# EAGLE design v0.2_4ch (EAGLE 7.6.0)
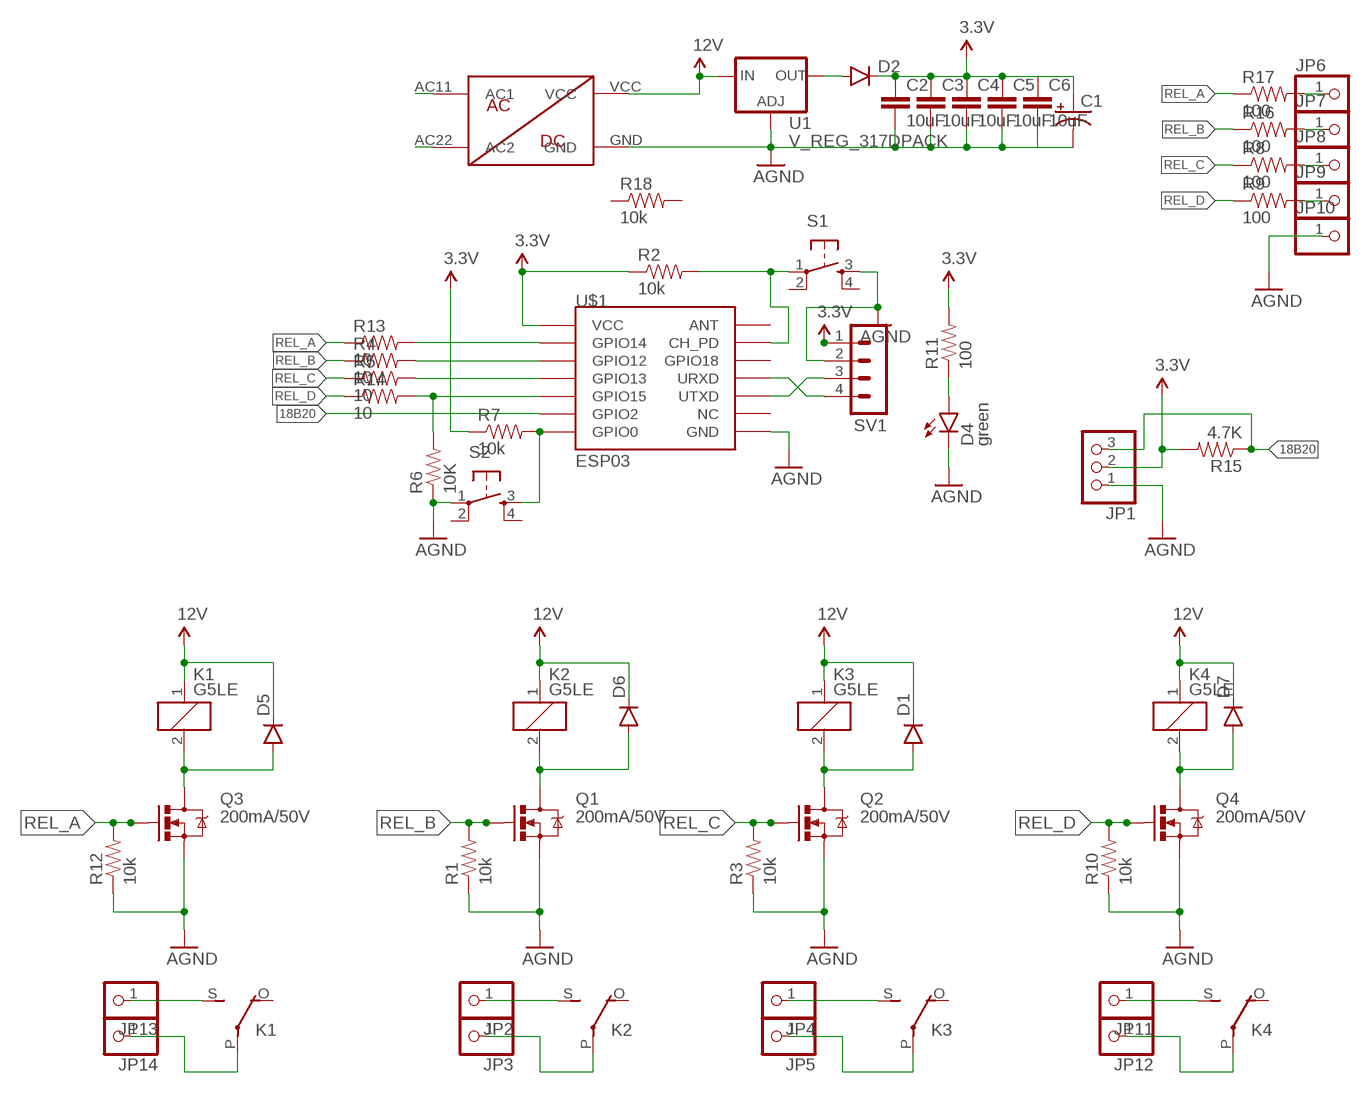
[diagram p0: schematic, sheet 1]

## Parts
C1  CAP_POLPTH3  [CPOL-RADIAL-1000UF-63V]
C2  10uF  10UF-6.3V-20%(0603)  [0603-CAP]
C3  10uF  10UF-6.3V-20%(0603)  [0603-CAP]
C4  10uF  10UF-6.3V-20%(0603)  [0603-CAP]
C5  10uF  10UF-6.3V-20%(0603)  [0603-CAP]
C6  10uF  10UF-6.3V-20%(0603)  [0603-CAP]
D1  DIODESOD123  [SOD-123]
D2  DIODESOD123  [SOD-123]
D4  green  LED0603  [LED-0603]
D5  DIODESOD123  [SOD-123]
D6  DIODESOD123  [SOD-123]
D7  DIODESOD123  [SOD-123]
JP1  PINHD-1X3  [1X03]
JP2  PINHD-1X1  [1X01]
JP3  PINHD-1X1  [1X01]
JP4  PINHD-1X1  [1X01]
JP5  PINHD-1X1  [1X01]
JP6  PINHD-1X1  [1X01]
JP7  PINHD-1X1  [1X01]
JP8  PINHD-1X1  [1X01]
JP9  PINHD-1X1  [1X01]
JP10  PINHD-1X1  [1X01]
JP11  PINHD-1X1  [1X01]
JP12  PINHD-1X1  [1X01]
JP13  PINHD-1X1  [1X01]
JP14  PINHD-1X1  [1X01]
K1  G5LE  [G5LE]
K2  G5LE  [G5LE]
K3  G5LE  [G5LE]
K4  G5LE  [G5LE]
Q1  200mA/50V  MOSFET-NCHANNELBSS138  [SOT23-3]
Q2  200mA/50V  MOSFET-NCHANNELBSS138  [SOT23-3]
Q3  200mA/50V  MOSFET-NCHANNELBSS138  [SOT23-3]
Q4  200mA/50V  MOSFET-NCHANNELBSS138  [SOT23-3]
R1  10k  RESISTOR0805-RES  [0805]
R2  10k  RESISTOR0805-RES  [0805]
R3  10k  RESISTOR0805-RES  [0805]
R4  10  RESISTOR0805-RES  [0805]
R5  10  RESISTOR0805-RES  [0805]
R6  10K  RESISTOR0805-RES  [0805]
R7  10k  RESISTOR0805-RES  [0805]
R8  100  RESISTOR0805-RES  [0805]
R9  100  RESISTOR0805-RES  [0805]
R10  10k  RESISTOR0805-RES  [0805]
R11  100  RESISTOR0805-RES  [0805]
R12  10k  RESISTOR0805-RES  [0805]
R13  10  RESISTOR0805-RES  [0805]
R14  10  RESISTOR0805-RES  [0805]
R15  4.7K  RESISTOR0805-RES  [0805]
R16  100  RESISTOR0805-RES  [0805]
R17  100  RESISTOR0805-RES  [0805]
R18  10k  RESISTOR0805-RES  [0805]
S1  TAC_SWITCHPTH  [TACTILE-PTH]
S2  TAC_SWITCHPTH  [TACTILE-PTH]
SV1  MA04-1  [MA04-1]
U1  V_REG_317DPACK  [V-REG_DPACK]
U$1  ESP03  [ESP03]
U$8  ACDC12V350MA  [ACDC12V350MA]

## Nets
3.3V: C1.1(+) C2.1 C3.1 C4.1 C5.1 C6.1 D2.C JP1.2 R2.1 R7.1 R11.2 R15.2 SV1.1 U$1.VCC
12V: D1.C D5.C D6.C D7.C K1.1 K2.1 K3.1 K4.1 U1.3(IN) U$8.VCC
18B20: JP1.3 R15.1 U$1.GPIO2
AGND: C1.2(-) C2.2 C3.2 C4.2 C5.2 C6.2 D4.C JP1.1 JP10.1 Q1.2(S) Q2.2(S) Q3.2(S) Q4.2(S) R1.1 R3.1 R6.1 R10.1 R12.1 S1.3 S2.1 SV1.2 U1.1(ADJ) U$1.GND U$8.GND
N$1: SV1.3 U$1.UTXD
N$2: SV1.4 U$1.URXD
N$3: D5.A K1.2 Q3.3(D)
N$4: R2.2 S1.1 U$1.CH_PD
N$5: U$8.AC11(AC1)
N$6: R4.2 U$1.GPIO12
N$7: R5.2 U$1.GPIO13
N$8: R6.2 R14.2 U$1.GPIO15
N$9: JP8.1 R8.2
N$10: JP9.1 R9.2
N$11: U$8.AC22(AC2)
N$12: R7.2 S2.3 U$1.GPIO0
N$16: D4.A R11.1
N$17: D6.A K2.2 Q1.3(D)
N$18: D7.A K4.2 Q4.3(D)
N$19: D1.A K3.2 Q2.3(D)
N$20: R13.2 U$1.GPIO14
N$21: JP13.1 K1.S(2:S)
N$22: JP14.1 K1.P(2:P)
N$23: JP12.1 K4.P(2:P)
N$24: JP11.1 K4.S(2:S)
N$25: JP5.1 K3.P(2:P)
N$26: JP4.1 K3.S(2:S)
N$27: JP2.1 K2.S(2:S)
N$28: JP3.1 K2.P(2:P)
N$29: JP7.1 R16.2
N$30: JP6.1 R17.2
N$40: D2.A U1.4(OUT)
REL_A: Q3.1(G) R12.2 R13.1 R17.1
REL_B: Q1.1(G) R1.2 R4.1 R16.1
REL_C: Q2.1(G) R3.2 R5.1 R8.1
REL_D: Q4.1(G) R9.1 R10.2 R14.1
Unconnected: K1.O(2:O) K2.O(2:O) K3.O(2:O) K4.O(2:O) R18.1 R18.2 S1.2 S1.4 S2.2 S2.4 U$1.ANT U$1.GPIO18 U$1.NC

## Library data of the parts
C1 = SparkFun-Passives:CAP_POL: Capacitor Polarized These are standard SMD and PTH capacitors. Normally 10uF, 47uF, and 100uF in electrolytic and tantalum varieties. Always verify the external diameter of the through hole cap, it varies with capacity, voltage, and manufacturer. The EIA devices should be standard.
C2-C6 = SparkFun-Capacitors:10UF-6.3V-20%(0603): CAP-11015; PROD_ID: CAP-11015
D1 D2 D5-D7 = SparkFun-DiscreteSemi:DIODE: Diode These are standard reverse protection diodes and small signal diodes. SMA package can handle up to about 1A. SOD-323 can handle about 200mA. What the SOD-323 package when ordering, there are some mfgs out there that are 5-pin packages.
D4 = SparkFun-LED:LED: LEDs Standard schematic elements and footprints for 5mm, 3mm, 1206, and 0603 sized LEDs. 5mm - Spark Fun Electronics SKU : COM-00529 (and others)
JP1 = pinhead:PINHD-1X3: PIN HEADER
JP2-JP14 = pinhead:PINHD-1X1: PIN HEADER
K1-K4 = relay:G5LE: RELAY 1 x switch, 10 A/120 V AC, 8 A/30 V DC, Omron; OC_FARNELL: unknown; OC_NEWARK: unknown
Q1-Q4 = SparkFun-DiscreteSemi:MOSFET-NCHANNEL: Common NMOSFET Parts MFG P/N Store ID Prod ID FDD8780 TRANS-09984 SI7820DN TRANS-11055 FDS6630A IC-08089 2N7002PW TRANS-11151 FQP30N06L COM-10213 TRANS-10060 BSS123LT1G TRANS-08345 BSS138 TRANS-00830 BS170 2N7000; PROD_ID: TRANS-00830
R1-R18 = SparkFun-Passives:RESISTOR: Resistor Basic schematic elements and footprints for 0603, 1206, and PTH resistors.
S1 S2 = SparkFun-Retired:TAC_SWITCH: Momentary Switch Button commonly used for reset or general input. Spark Fun Electronics SKU : COM-00097 SMT- SWCH-08247
SV1 = con-lstb:MA04-1: PIN HEADER; OC_FARNELL: unknown; OC_NEWARK: unknown
U1 = SparkFun-PowerIC:V_REG_317: Voltage Regulator Standard LM317 adjustable voltage regulator. AOI (Adjust Output Input). Google 'LM317 Calculator' for easy to use app to get the two resistor values needed. 240/720 for 5V output. 240/390 for 3.3V output. Spark Fun Electronics SKU : COM-00527; PROD_ID: IC-09888
U$1 = esp8266modules:ESP03: ESP8266 Wifi module 03; DIMENSIONS: 17.3 x 12.1 mm; PINS: 14; PITCH: 0.078" / 2 mm
U$8 = rel:ACDC12V350MA

## Board
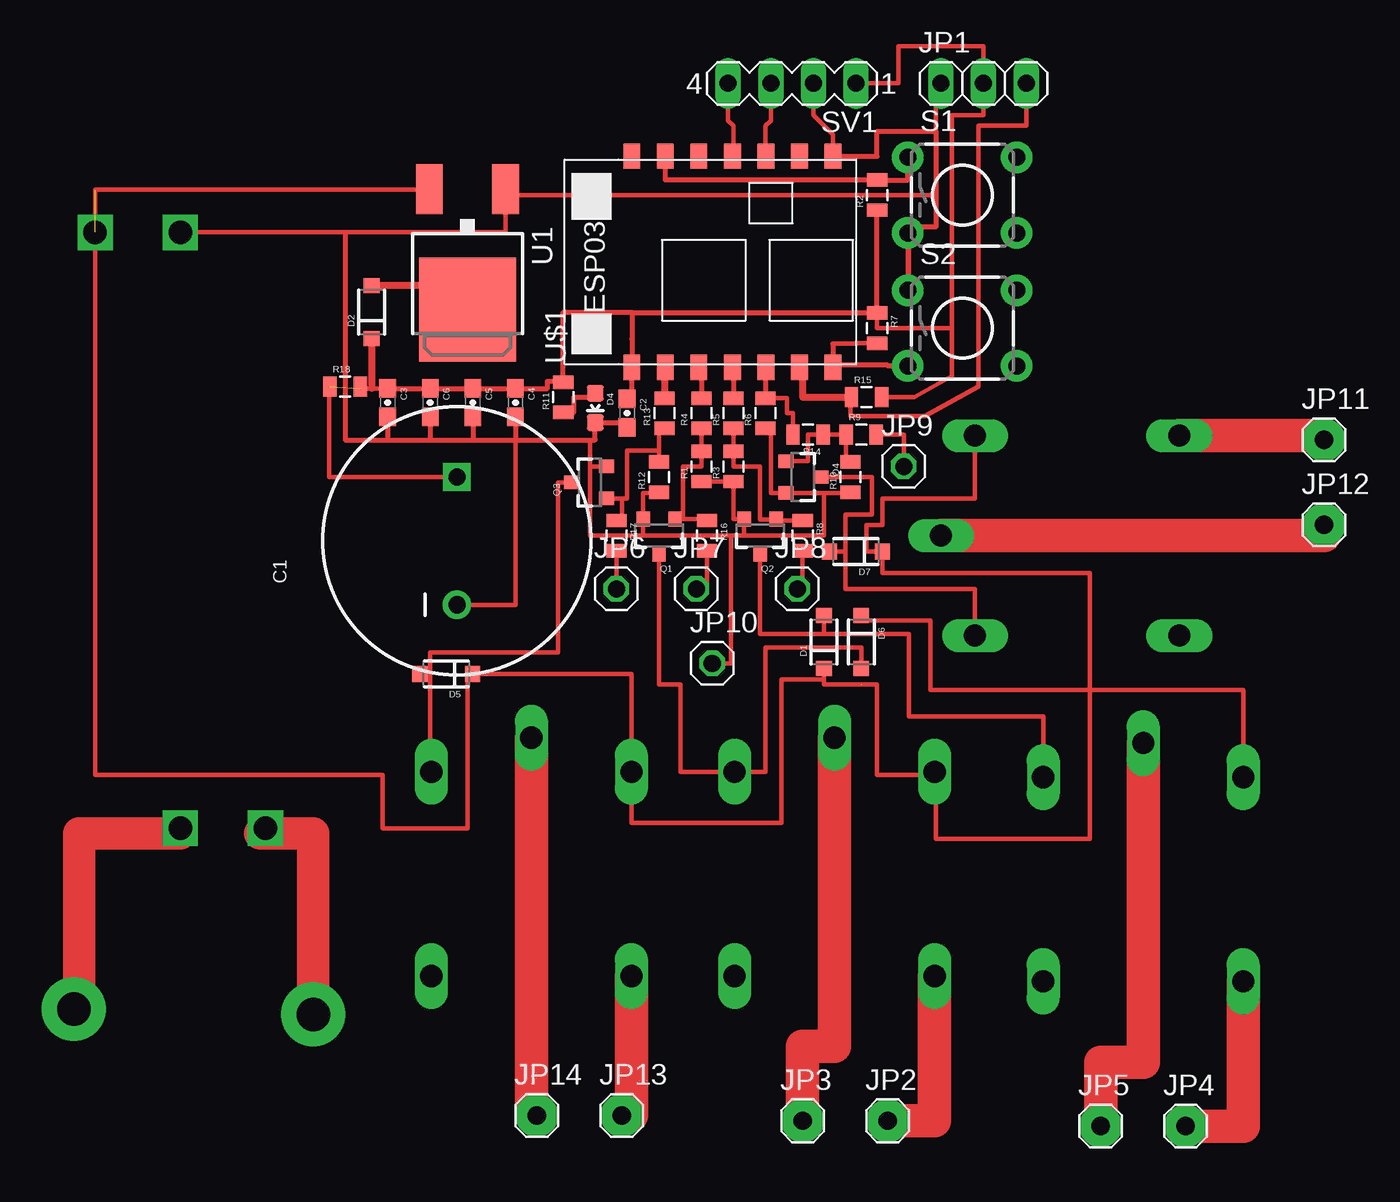
[diagram p1: board, top side]
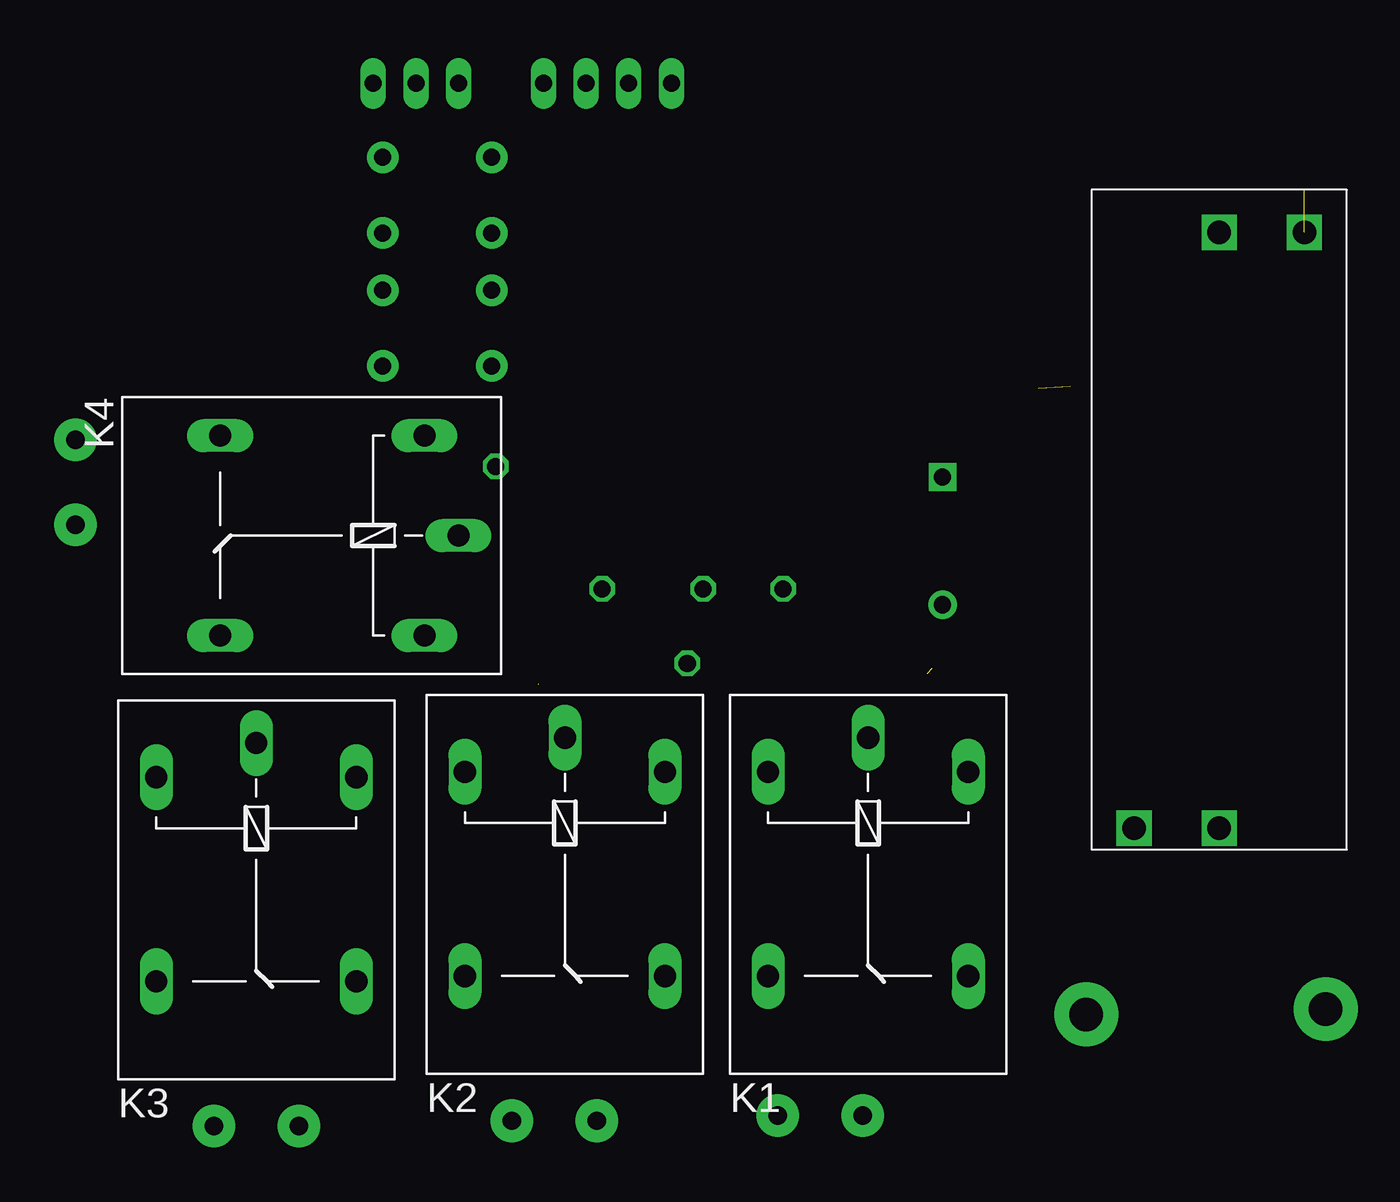
[diagram p2: board, bottom side, seen from below]

No outline drawn. Coordinates in mm, seen from the top.
Copper layers (1*16): Top 0.035mm / dielectric 1.5mm / Bottom 0.035mm
Design rules "default": minimum track width 10mil, minimum drill 24mil, track to track 8mil, track to pad 8mil, pad to pad 8mil, via to via 8mil, smd to smd 8mil, copper to edge 40mil, drill to drill 8mil, minimum pad ring 10mil, minimum via ring 8mil, stop-mask expansion 4mil, vias tented up to drill 0mil, thermal gap 10mil

### Footprints (pad centres in the part's own frame; a part is rotated, then mirrored left to right if it is on the bottom)
CPOL-RADIAL-1000UF-63V = drill 1.016 pad 1.651 square: 1 3.81,0 | drill 1.016 pad 1.676: 2 -3.81,0
0603-CAP = smd 1.1 x 1: 1 -0.85,0; 2 0.85,0
SOD-123 = smd 0.9 x 0.95: A 1.575,0; C -1.575,0
LED-0603 = smd 1 x 1: A 0,-0.877; C 0,0.877
1X03 = drill 1.016 long: 1 -2.54,0; 2 0,0; 3 2.54,0
1X01 = drill 1.016 octagon: 1 0,0
G5LE = drill 1.321 long: 1 -7.493,-5.969; 2 -7.493,5.969; O 4.699,5.969; P -9.525,0; S 4.699,-5.969
SOT23-3 = smd 0.8 x 0.9: 1 -0.95,-1; 2 0.95,-1; 3 0,1.1
0805 = smd 0.8 x 1.2: 1 -0.9,0; 2 0.9,0
TACTILE-PTH = drill 1.016 pad 1.88: 1 -3.251,2.261; 2 3.251,2.261; 3 -3.251,-2.261; 4 3.251,-2.261
MA04-1 = drill 1.016 long: 1 -3.81,0; 2 -1.27,0; 3 1.27,0; 4 3.81,0
V-REG_DPACK = smd 1.6 x 3: 1 -2.28,-4.8; 3 2.28,-4.8 | smd 5.8 x 6.2: 4 0,2.38
ESP03 = smd 1.5 x 1: ANT 7.4,4.8; CH_PD 7.4,2.8; GND 7.4,-7.2; GPIO0 -5.2,-7.2; GPIO2 -5.2,-5.2; GPIO12 -5.2,0.8; GPIO13 -5.2,-1.2; GPIO14 -5.2,2.8; GPIO15 -5.2,-3.2; GPIO18 7.4,0.8; NC 7.4,-5.2; URXD 7.4,-1.2; UTXD 7.4,-3.2; VCC -5.2,4.8
ACDC12V350MA = drill 1.4 square: AC11 1.27,12.7; AC22 1.27,7.62; GND 36.83,7.62; VCC 36.83,2.54

### Placement (x,y rotation side)
C1  29.21,38.1 90 top
C2  39.37,45.72 270 top
C3  25.08,46.35 270 top
C4  32.7,46.35 270 top
C5  30.16,46.35 270 top
C6  27.62,46.35 270 top
D1  51.12,32.07 90 top
D2  24.13,51.75 90 top
D4  37.47,46.04 180 top
D5  28.57,30.16 180 top
D6  53.34,32.07 270 top
D7  53.02,37.47 180 top
JP1  60.64,65.41 0 top
JP2  54.93,3.49 0 top
JP3  49.85,3.49 0 top
JP4  72.71,3.17 0 top
JP5  67.63,3.17 0 top
JP6  38.73,35.24 0 top
JP7  43.5,35.24 0 top
JP8  49.53,35.24 0 top
JP9  55.88,42.55 0 top
JP10  44.45,30.8 0 top
JP11  80.96,44.13 0 top
JP12  80.96,39.05 0 top
JP13  39.05,3.81 0 top
JP14  33.97,3.81 0 top
K1  33.66,16.83 270 bottom
K2  51.75,16.83 270 bottom
K3  70.17,16.51 270 bottom
K4  67.63,38.42 180 bottom
Q1  41.27,38.42 180 top
Q2  47.31,38.42 180 top
Q3  37.15,41.59 90 top
Q4  49.85,41.91 270 top
R1  43.81,42.55 90 top
R2  54.29,58.74 90 top
R3  45.72,42.55 90 top
R4  43.81,45.72 90 top
R5  45.72,45.72 90 top
R6  47.62,45.72 90 top
R7  54.29,50.8 270 top
R8  49.85,38.42 270 top
R9  53.34,44.45 0 top
R10  52.7,41.91 90 top
R11  35.56,46.67 90 top
R12  41.27,41.91 90 top
R13  41.59,45.72 90 top
R14  50.16,44.45 180 top
R15  53.66,46.67 0 top
R16  44.13,38.42 270 top
R17  38.73,38.42 270 top
R18  22.54,47.31 0 top
S1  59.37,58.74 0 top
S2  59.37,50.8 0 top
SV1  49.21,65.41 180 top
U1  29.84,54.29 180 top
U$1  44.45,53.66 90 top
U$8  5.08,19.68 90 bottom

### Tracks (layer width: path | path; a pad name or v marks a point on that pad's centre or on a via)
3.3V  (1 unrouted)
  Top 0.254: R15.2 56.52,46.67 58.74,47.94 58.74,50.8 | 58.74,50.8 54.29,50.8 R7.1 | C3.1 24.13,47.2 23.5,47.2 23.5,47.31 | C1.1 21.59,41.91 21.59,47.31 | SV1.1 55.56,65.41 55.56,67.63 60.64,67.63 JP1.2 60.64,63.5 58.74,63.5 58.74,50.8
  Top 0.305: 39.69,51.7 R7.1 R2.1 | 39.69,51.7 39.69,51.75 35.56,51.75 R11.2 35.56,47.62 34.61,47.62 34.61,47.2 C4.1 C5.1 C6.1 C3.1 | 39.69,51.7 39.69,50.16 39.65,50.16 U$1.VCC 39.65,46.57 C2.1
  Top 0.406: D2.C 24.13,47.2
12V  (3 unrouted)
  Top 0.254: 53.33,29.53 51.12,29.53 51.12,29.84 | 51.12,29.84 48.58,29.84 48.58,21.27 39.62,21.27 K1.1 39.62,30.16 D5.C | 66.99,29.21 66.99,20.32 57.78,20.32 57.78,24.32 K2.1 57.72,24.13 54.29,24.13 54.29,29.53 53.34,29.53 | 66.99,29.21 76.14,29.21 K3.1 | 66.99,29.21 66.99,36.2 54.61,36.2 54.61,37.15 D7.C 53.66,37.47 53.66,39.05 54.61,39.05 54.61,40.64 60.13,40.64 K4.1 | 29.84,30.48 29.84,20.95 24.77,20.95 24.77,24.13 7.62,24.13 7.62,59.05 27.57,59.05 U1.3 | D1.C 51.12,29.84 | 66.99,29.21 57.47,29.21 57.47,33.34 53.34,33.34 D6.C
18B20
  Top 0.254: 49.85,46.67 52.7,46.67 52.7,45.56 57.15,45.56 60.33,47.31 60.33,62.87 63.18,62.87 JP1.3
  Top 0.406: U$1.GPIO2 49.85,48.46 49.85,46.67 R15.1
AGND
  Top 0.254: U$8.GND 22.54,56.52 32.12,56.52 32.12,58.74 | 37.47,44.13 37.15,44.13 37.15,42.55 | 37.15,42.55 Q3.2 | 37.15,42.55 37.15,38.42 40.32,38.42 | 40.32,38.42 40.33,38.42 | 40.33,38.42 Q1.2 | Q1.2 40.32,38.42 | 40.33,38.42 45.56,38.42 | 45.56,38.42 46.36,38.42 | 46.36,38.42 Q2.2 45.72,39.42 R3.1 R1.1 | Q1.2 40.32,40.96 41.27,40.96 R12.1 | 51.12,40.96 Q4.2 47.94,40.96 47.94,44.82 R6.1 | 51.12,40.96 51.12,38.42 46.36,38.42 | 51.12,40.96 52.7,40.96 R10.1 | S2.1 56.2,53.06 56.2,56.83 | 57.78,58.74 32.12,58.74 | 32.12,58.74 U1.1 | JP10.1 45.56,30.8 45.56,38.42 | C1.2 32.7,34.29 32.7,44.13 | U$1.GND 51.65,62.33 50.48,63.5 SV1.2 | JP1.1 57.78,65.41 57.78,62.55
  Top 0.305: S2.1 S1.3 56.12,56.83 56.2,56.83 57.78,56.83 57.78,58.74 57.78,62.55 54.29,62.55 54.29,61.06 U$1.GND | 25.08,44.13 22.54,44.13 22.54,56.52 | 25.08,44.13 27.62,44.13 | 27.62,44.13 30.16,44.13 | 30.16,44.13 32.7,44.13 | C3.2 25.08,44.13 | C6.2 27.62,44.13 | C5.2 30.16,44.13 | C4.2 32.7,44.13 | 32.7,44.13 37.47,44.13 D4.C 39.69,45.16 C2.2
N$1
  Top 0.254: SV1.3 47.94,63.18 47.62,62.87 47.62,61.08 U$1.UTXD
N$2
  Top 0.254: SV1.4 45.4,63.18 45.72,62.87 45.72,61.13 U$1.URXD
N$3
  Top 0.254: K1.2 27.62,24.32 27.62,30.16 | Q3.3 35.24,41.59 35.24,31.43 27.62,31.43 27.62,30.16 | D5.A 27.62,30.16
N$4
  Top 0.305: U$1.CH_PD | 41.54,61.06 U$1.CH_PD | U$1.CH_PD 41.65,59.64 R2.2 56.12,59.64 S1.1
N$6
  Top 0.305: U$1.GPIO12 43.81,48.46 R4.2
N$7
  Top 0.305: U$1.GPIO13 45.72,48.46 R5.2
N$8
  Top 0.254: R6.2 48.9,46.62 48.9,45.72 49.27,45.72 R14.2
  Top 0.305: U$1.GPIO15 47.62,48.46 R6.2
N$9
  Top 0.254: JP8.1 49.85,35.24 R8.2
N$10
  Top 0.254: JP9.1 55.88,44.45 R9.2
N$12
  Top 0.305: R7.2 51.65,49.85 U$1.GPIO0 51.65,48.58 54.93,48.58 54.93,48.54 S2.3
N$13
  Top 1.93: 12.7,20.64 6.67,20.64 6.67,10.16
N$14  (via drill 2 pad 3.81)
  other vias: 6.35,10.16
N$15  (via drill 2 pad 3.81)
  Top 1.93: 17.46,20.64 20.64,20.64 v20.64,9.84
N$16
  Top 0.305: R11.1 36.2,45.77 36.2,46.67 37.47,46.67 D4.A
N$17
  Top 0.254: Q1.3 41.27,29.53 42.55,29.53 42.55,24.32 K2.2 47.62,24.32 47.62,31.75 53.34,31.75 D6.A
N$18
  Top 0.254: Q4.3 53.98,41.91 53.98,39.69 52.39,39.69 52.39,37.47 | 52.39,37.47 D7.A | 52.39,37.47 52.39,35.24 60.13,35.24 K4.2
N$19
  Top 0.254: Q2.3 47.31,32.54 51.12,32.54 | K3.2 64.2,27.62 56.2,27.62 56.2,32.54 51.12,32.54 | 51.12,33.66 D1.A 51.12,32.54
N$20
  Top 0.406: U$1.GPIO14 41.59,48.46 R13.2
N$21
  Top 2: JP13.1 39.62,3.81 K1.S
N$22
  Top 2: JP14.1 33.66,3.81 K1.P
N$23
  Top 2: K4.P 80.96,38.42 JP12.1
N$24
  Top 2: K4.S 80.96,44.39 JP11.1
N$25
  Top 2: JP5.1 67.63,6.99 70.17,6.99 K3.P
N$26
  Top 2: JP4.1 76.14,3.17 K3.S
N$27
  Top 2: JP2.1 57.72,3.49 K2.S
N$28
  Top 2: JP3.1 49.85,7.94 51.75,7.94 K2.P
N$29
  Top 0.254: JP7.1 44.13,35.24 R16.2
N$30
  Top 0.254: JP6.1 R17.2
N$32  (via drill 1.1 pad 2.54)
  other vias: 54.93,3.49
N$33  (via drill 1.1 pad 2.54)
  other vias: 49.85,3.49
N$34  (via drill 1.1 pad 2.54)
  other vias: 39.05,3.81
N$35  (via drill 1.1 pad 2.54)
  other vias: 33.97,3.81
N$36  (via drill 1.1 pad 2.54)
  other vias: 72.71,3.17
N$37  (via drill 1.1 pad 2.54)
  other vias: 67.63,3.17
N$38  (via drill 1.1 pad 2.54)
  other vias: 80.96,44.13
N$39  (via drill 1.1 pad 2.54)
  other vias: 80.96,39.05
N$40
  Top 0.406: U1.4 28.89,51.91 28.89,53.34 D2.A
REL_A
  Top 0.254: R17.1 39.05,39.32 39.05,40.64 | 39.05,40.64 Q3.1 | 41.27,43.5 39.37,43.5 39.37,40.64 39.05,40.64 | 41.27,43.5 R12.2 | R13.1 41.27,44.82 41.27,43.5
REL_B
  Top 0.254: R4.1 R1.2 43.81,42.55 42.7,42.55 42.7,39.42 Q1.1 44.13,39.42 R16.1
REL_C
  Top 0.254: R5.1 R3.2 45.72,42.55 47.31,42.55 47.31,39.37 48.26,39.37 Q2.1 48.26,39.32 R8.1
REL_D
  Top 0.254: Q4.1 50.16,42.86 50.16,44.45 R14.1 R9.1 52.44,42.81 R10.2